# EAGLE schematic ECE 312 LAB - Diode Temperture Sensor (EAGLE 7.5.0)
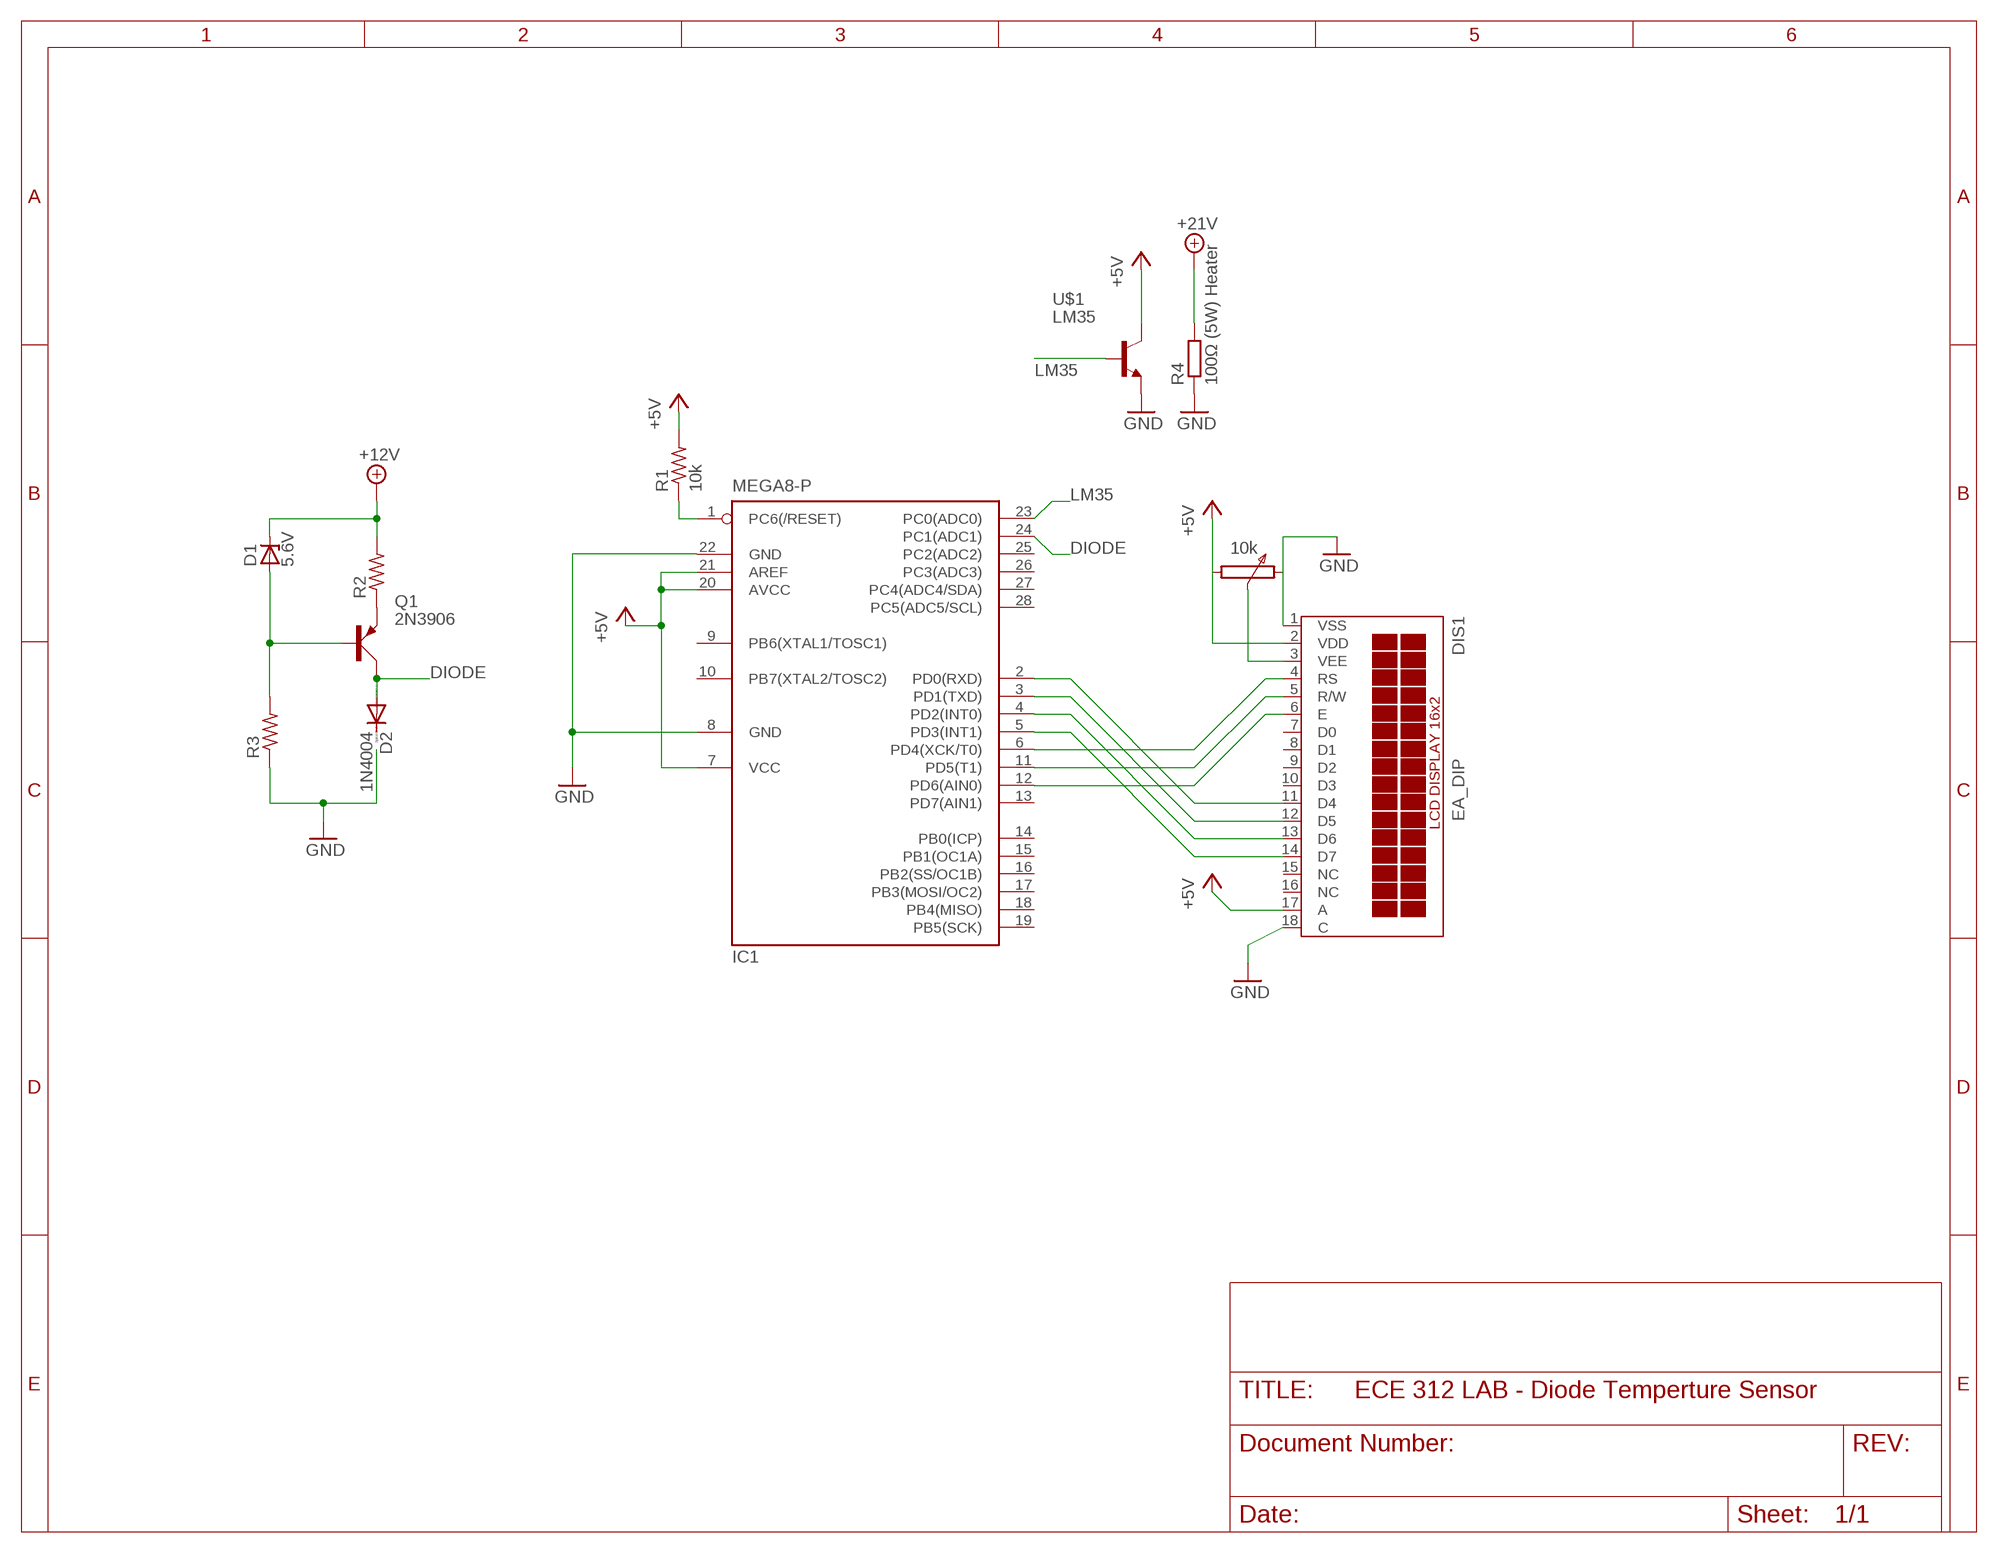
[diagram p0: schematic, sheet 1]

## Parts
D1  5.6V  ZENER-DIODEC1702-15  [C1702-15]
D2  1N4004  [DO41-10]
DIS1  EA_DIP  [EA_DIP]
IC1  MEGA8-P  [DIL28-3]
Q1  2N3906  [TO92D]
R1  10k  R-US_0204/2V  [0204V]
R2  R-US_0204/2V  [0204V]
R3  R-US_0204/2V  [0204V]
R4  100Ω (5W) Heater  R-EU_0204/2V  [0204V]
U$1  LM35  [TO220]

## Nets
+5V: DIS1.2(VDD) DIS1.17(A) IC1.7(VCC) IC1.20(AVCC) IC1.21(AREF) R1.2 U$1.2(C)
+12V: D1.C R2.2
+21V: R4.2
DIODE: D2.A IC1.24(PC1(ADC1)) Q1.C
GND: DIS1.1(VSS) DIS1.18(C) IC1.8(GND) IC1.22(GND) R3.1 R4.1 U$1.3(E)
LM35: IC1.23(PC0(ADC0)) U$1.1(B)
N$1: IC1.1(PC6(/RESET)) R1.1
N$2: DIS1.3(VEE)
N$3: DIS1.11(D4) IC1.2(PD0(RXD))
N$4: DIS1.12(D5) IC1.3(PD1(TXD))
N$5: DIS1.13(D6) IC1.4(PD2(INT0))
N$6: DIS1.14(D7) IC1.5(PD3(INT1))
N$7: DIS1.4(RS) IC1.6(PD4(XCK/T0))
N$8: DIS1.5(R/W) IC1.11(PD5(T1))
N$9: DIS1.6(E) IC1.12(PD6(AIN0))
N$10: Q1.E R2.1
N$12: D1.A Q1.B R3.2
Unconnected: D2.C DIS1.7(D0) DIS1.8(D1) DIS1.9(D2) DIS1.10(D3) DIS1.15(NC) DIS1.16(NC) IC1.9(PB6(XTAL1/TOSC1)) IC1.10(PB7(XTAL2/TOSC2)) IC1.13(PD7(AIN1)) IC1.14(PB0(ICP)) IC1.15(PB1(OC1A)) IC1.16(PB2(SS/OC1B)) IC1.17(PB3(MOSI/OC2)) IC1.18(PB4(MISO)) IC1.19(PB5(SCK)) IC1.25(PC2(ADC2)) IC1.26(PC3(ADC3)) IC1.27(PC4(ADC4/SDA)) IC1.28(PC5(ADC5/SCL))

## Notes on the sheet
- 10k

## Library data of the parts
D1 = diode:ZENER-DIODE: Z-Diode
D2 = diode:1N4004: DIODE general purpose rectifier, 1 A
DIS1 = display-lcd:EA_DIP: LCD-MODUL 2x16 - 6,68mm, INKL. KONTROLLER HD44780 Source: Data sheet <http://www.lcd-module.de/pdf/doma/dip162-d.pdf>
IC1 = atmel:MEGA8-P: MICROCONTROLLER 8 Kbytes FLASH, 1 kbytes SRAM, 512 bytes EEPROM, USART, 4-channel 10 bit ADC, 2-channel 8 bit ADC Pin compatible with Atmega48, ATMega88, ATMega168 Source: avr.lbr; OC_FARNELL: unknown; OC_NEWARK: unknown
Q1 = transistor-small-signal:2N3906: PNP TRANSISTOR
R1-R3 = resistor:R-US_: RESISTOR, American symbol
R4 = resistor:R-EU_: RESISTOR, European symbol
U$1 = transistor-npn:LM35